# EAGLE design relay AZ850P2 THT (EAGLE 6.2)
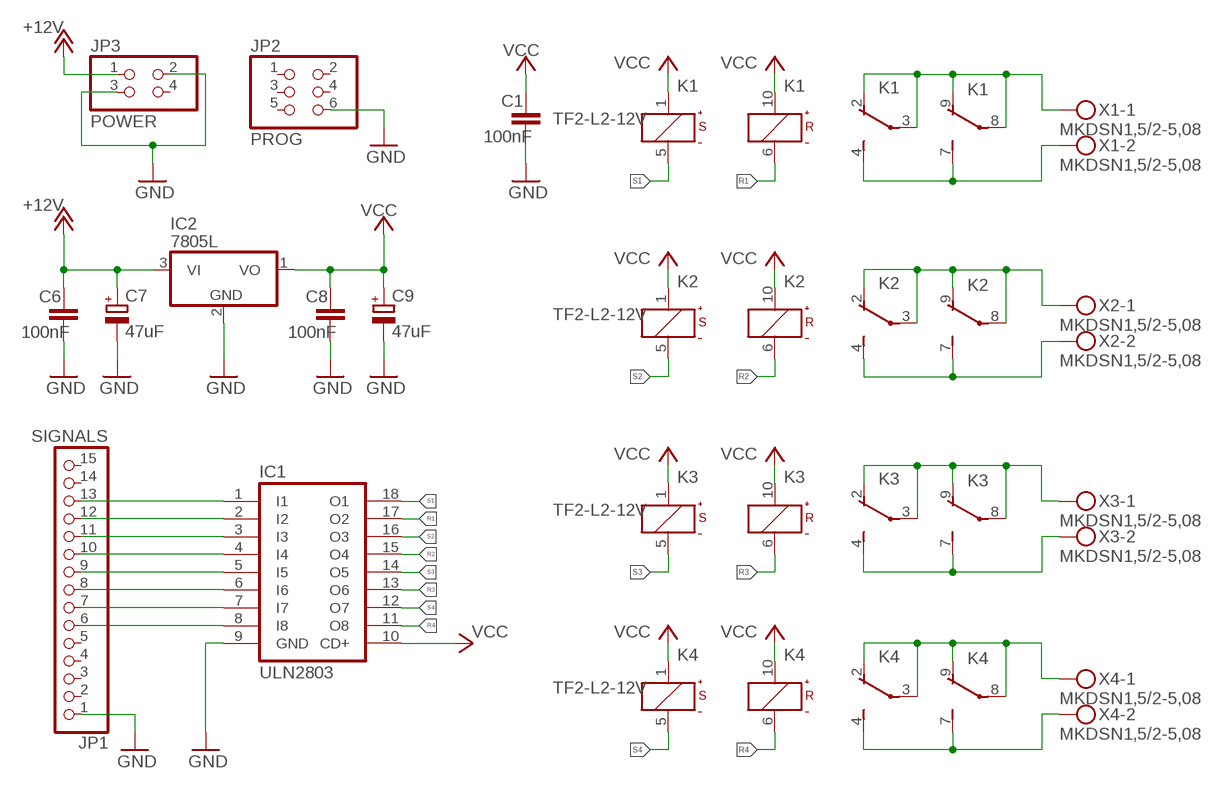
[diagram p0: schematic, sheet 1]

## Parts
C1  100nF  C-EU025-025X050  [C025-025X050]
C6  100nF  C-EU025-025X050  [C025-025X050]
C7  47uF  CPOL-EUE2.5-6  [E2,5-6]
C8  100nF  C-EU025-025X050  [C025-025X050]
C9  47uF  CPOL-EUE2.5-6  [E2,5-6]
IC1  ULN2803  ULN2803A  [DIL18]
IC2  7805L  [TO92]
JP1  SIGNALS  PINHD-1X15  [1X15]
JP2  PROG  PINHD-2X3  [2X03]
JP3  POWER  PINHD-2X2  [2X02]
K1  TF2-L2-12V  [TF2]
K2  TF2-L2-12V  [TF2]
K3  TF2-L2-12V  [TF2]
K4  TF2-L2-12V  [TF2]
X1  MKDSN1,5/2-5,08  [MKDSN1,5/2-5,08]
X2  MKDSN1,5/2-5,08  [MKDSN1,5/2-5,08]
X3  MKDSN1,5/2-5,08  [MKDSN1,5/2-5,08]
X4  MKDSN1,5/2-5,08  [MKDSN1,5/2-5,08]

## Nets
+12V: C6.1 C7.+ IC2.3(VI) JP3.1
GND: C1.2 C6.2 C7.- C8.2 C9.- IC1.9(GND) IC2.2(GND) JP1.1 JP2.6 JP3.2 JP3.3
N$1: IC1.1(I1) JP1.13
N$2: IC1.2(I2) JP1.12
N$3: IC1.3(I3) JP1.11
N$4: IC1.4(I4) JP1.10
N$5: IC1.5(I5) JP1.9
N$6: IC1.6(I6) JP1.8
N$7: IC1.7(I7) JP1.7
N$8: IC1.8(I8) JP1.6
N$9: K1.2(1:O) K1.3(1:P) K1.8(2:P) K1.9(2:O) X1.1
N$10: K1.4(1:S) K1.7(2:S) X1.2
N$11: K2.2(1:O) K2.3(1:P) K2.8(2:P) K2.9(2:O) X2.1
N$12: K2.4(1:S) K2.7(2:S) X2.2
N$13: K3.2(1:O) K3.3(1:P) K3.8(2:P) K3.9(2:O) X3.1
N$14: K3.4(1:S) K3.7(2:S) X3.2
N$15: K4.4(1:S) K4.7(2:S) X4.2
N$16: K4.2(1:O) K4.3(1:P) K4.8(2:P) K4.9(2:O) X4.1
R1: IC1.17(O2) K1.6(R:-)
R2: IC1.15(O4) K2.6(R:-)
R3: IC1.13(O6) K3.6(R:-)
R4: IC1.11(O8) K4.6(R:-)
S1: IC1.18(O1) K1.5(S:-)
S2: IC1.16(O3) K2.5(S:-)
S3: IC1.14(O5) K3.5(S:-)
S4: IC1.12(O7) K4.5(S:-)
VCC: C1.1 C8.1 C9.+ IC1.10(CD+) IC2.1(VO) K1.1(S:+) K1.10(R:+) K2.1(S:+) K2.10(R:+) K3.1(S:+) K3.10(R:+) K4.1(S:+) K4.10(R:+)
Unconnected: JP1.2 JP1.3 JP1.4 JP1.5 JP1.14 JP1.15 JP2.1 JP2.2 JP2.3 JP2.4 JP2.5 JP3.4

## Library data of the parts
C1 C6 C8 = rcl:C-EU: CAPACITOR, European symbol
C7 C9 = rcl:CPOL-EU: POLARIZED CAPACITOR, European symbol
IC1 = uln-udn:ULN2803A: DRIVER ARRAY
IC2 = linear:78*: Positive VOLTAGE REGULATOR Source: http://cache.national.com/ds/LM/LM78L05.pdf http://www.fairchildsemi.com/ds/LM/LM7805.pdf
JP1 = pinhead:PINHD-1X15: PIN HEADER
JP2 = pinhead:PINHD-2X3: PIN HEADER
JP3 = pinhead:PINHD-2X2: PIN HEADER
K1-K4 = relay:TF2-L2*: SMALL POLARIZED RELAY WITH HIGH SENSITIVITY NAiS 2 coil latching Source: http://www.mew-europe.com/.. en_ds_61017_0000.pdf; OC_FARNELL: unknown; OC_NEWARK: unknown
X1-X4 = con-phoenix-508:MKDSN1,5/2-5,08: MKDSN 1,5/ 2-5,08 Printklemme Nennstrom: 13,5 A Nennspannung: 250 V Rastermaß: 5,08 mm Polzahl: 2 Anschlussart: Schraubanschluss Montage: Löten Anschlussrichtung Leiter/Platine: 0 ° Artikelnummer: 1729128 Source: http://eshop.phoenixcontact.com .. 1729128.pdf; MPN: MKDSN 1,5/2-5.08; OC_FARNELL: 1792903; OC_NEWARK: 30M2397

## Board
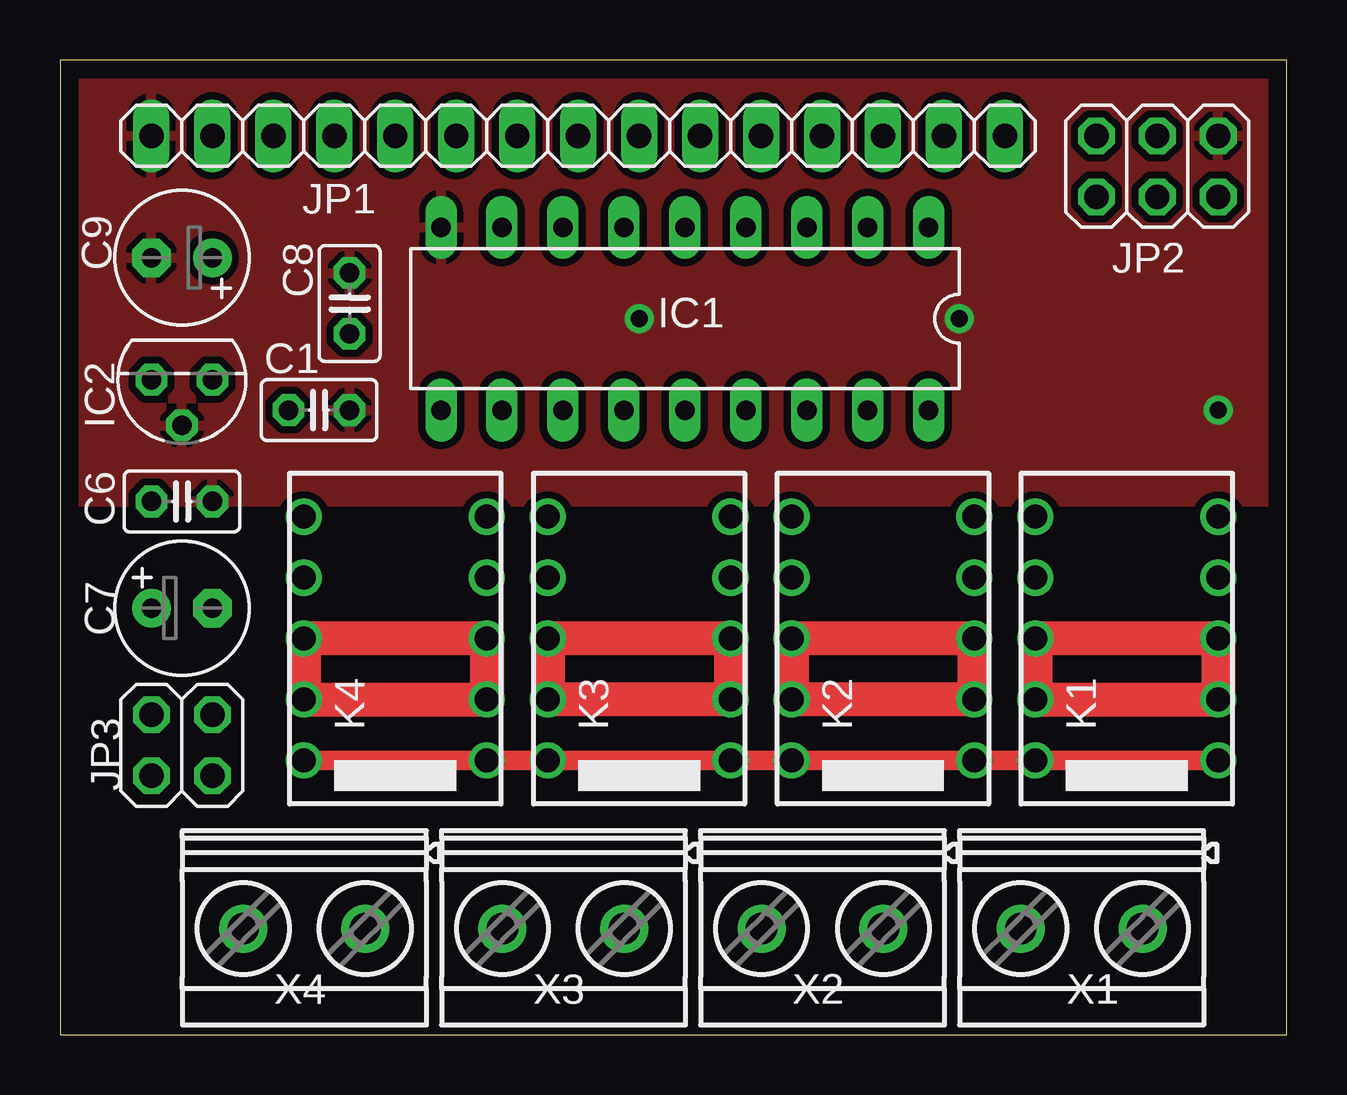
[diagram p1: board, top side]
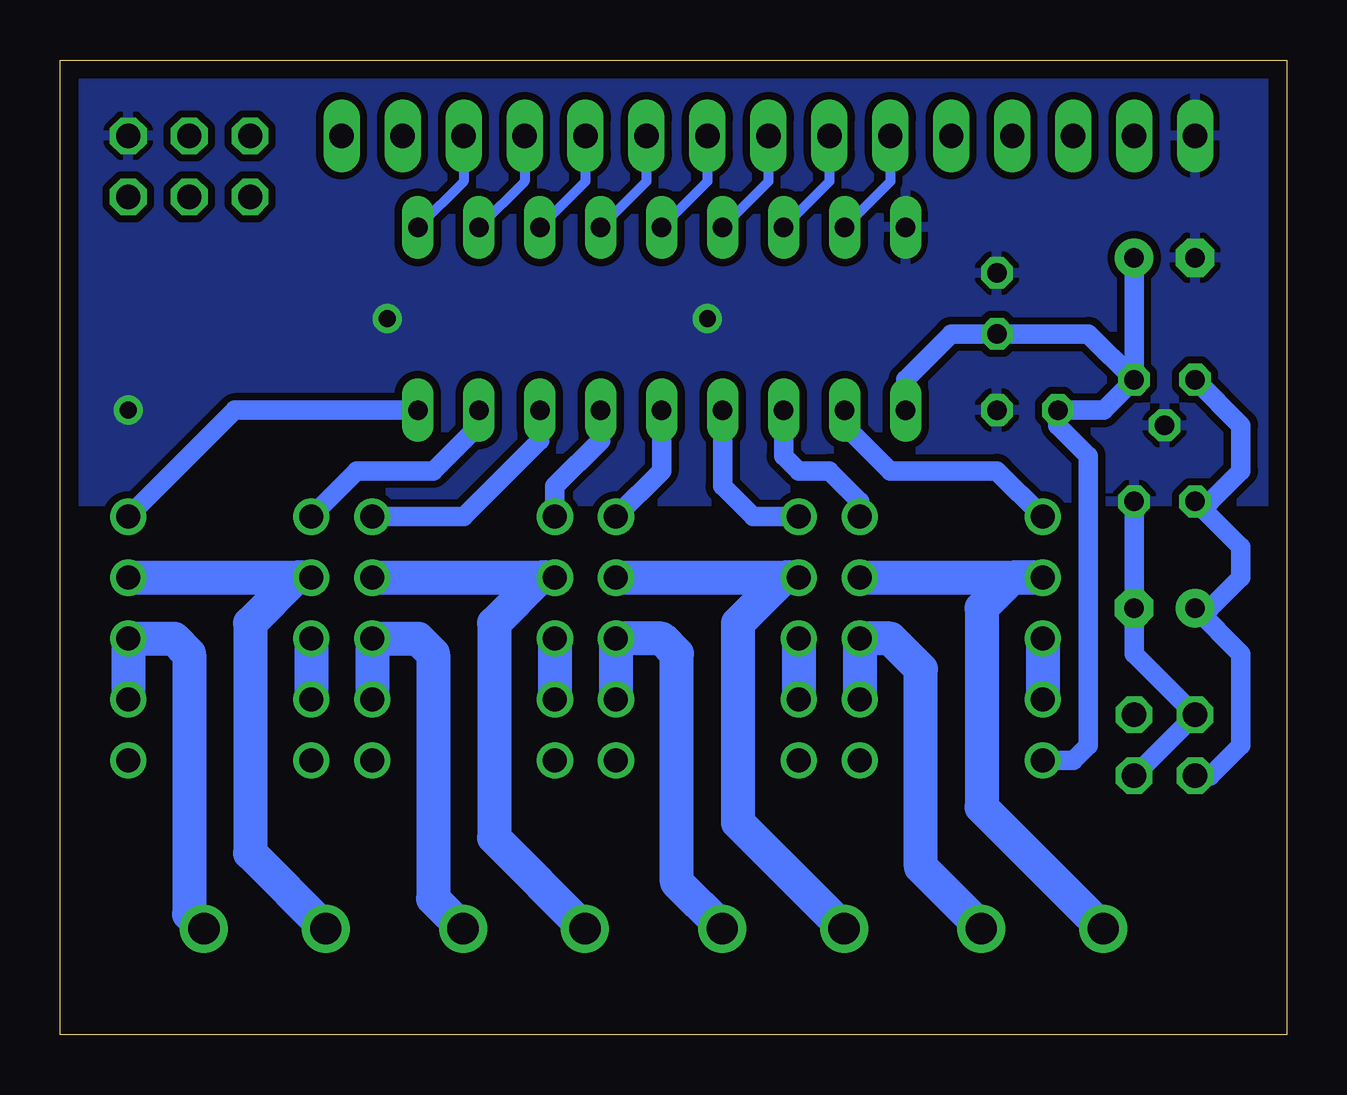
[diagram p2: board, bottom side, seen from below]

Size 51.1 x 40.63 mm. Coordinates in mm from the lower left corner, seen from the top.
Outline: 0,0 51.1,0 51.1,40.63 0,40.63 0,0
Copper layers (1*16): Top 0.035mm / dielectric 1.5mm / Bottom 0.035mm
Design rules: minimum track width 12mil, minimum drill 24mil, track to track 12mil, track to pad 12mil, pad to pad 12mil, via to via 12mil, smd to smd 8mil, copper to edge 30mil, drill to drill 12mil, minimum pad ring 10mil, minimum via ring 10mil, stop-mask expansion 4mil, vias tented up to drill 0mil, thermal gap 10mil

### Footprints (pad centres in the part's own frame; a part is rotated, then mirrored left to right if it is on the bottom)
C025-025X050 = drill 0.813 octagon: 1 -1.27,0; 2 1.27,0
E2,5-6 = drill 0.813 pad 1.6: + -1.27,0 | drill 0.813 pad 1.6 octagon: - 1.27,0
DIL18 = drill 0.813 long: 1 -10.16,-3.81; 2 -7.62,-3.81; 3 -5.08,-3.81; 4 -2.54,-3.81; 5 0,-3.81; 6 2.54,-3.81; 7 5.08,-3.81; 8 7.62,-3.81; 9 10.16,-3.81; 10 10.16,3.81; 11 7.62,3.81; 12 5.08,3.81; 13 2.54,3.81; 14 0,3.81; 15 -2.54,3.81; 16 -5.08,3.81; 17 -7.62,3.81; 18 -10.16,3.81
TO92 = drill 0.813 octagon: 1 -1.27,0; 2 0,1.905; 3 1.27,0
1X15 = drill 1.016 long: 1 -17.78,0; 2 -15.24,0; 3 -12.7,0; 4 -10.16,0; 5 -7.62,0; 6 -5.08,0; 7 -2.54,0; 8 0,0; 9 2.54,0; 10 5.08,0; 11 7.62,0; 12 10.16,0; 13 12.7,0; 14 15.24,0; 15 17.78,0
2X03 = drill 1.016 octagon: 1 -2.54,-1.27; 2 -2.54,1.27; 3 0,-1.27; 4 0,1.27; 5 2.54,-1.27; 6 2.54,1.27
2X02 = drill 1.016 octagon: 1 -1.27,-1.27; 2 -1.27,1.27; 3 1.27,-1.27; 4 1.27,1.27
TF2 = drill 1: 1 -5.08,-3.81; 2 -2.54,-3.81; 3 0,-3.81; 4 2.54,-3.81; 5 5.08,-3.81; 6 5.08,3.81; 7 2.54,3.81; 8 0,3.81; 9 -2.54,3.81; 10 -5.08,3.81
MKDSN1,5/2-5,08 = drill 1.3 pad 2: 1 -2.561,0.025; 2 2.519,0.025

### Placement (x,y rotation side)
C1  10.79,26.04 0 top
C6  5.08,22.23 0 top
C7  5.08,17.78 0 top
C8  12.06,30.48 90 top
C9  5.08,32.38 180 top
IC1  26.04,29.84 180 top
IC2  5.08,27.3 180 top
JP1  21.59,37.47 0 top
JP2  45.72,36.2 0 top
JP3  5.08,12.06 0 top
K1  44.45,16.51 90 top
K2  34.29,16.51 90 top
K3  24.13,16.51 90 top
K4  13.97,16.51 90 top
X1  42.55,4.45 180 top
X2  31.75,4.45 180 top
X3  20.95,4.45 180 top
X4  10.16,4.45 180 top

### Tracks (layer width: path | path; a pad name or v marks a point on that pad's centre or on a via)
+12V
  Bottom 0.813: JP3.1 3.17,10.79 1.91,12.06 1.91,15.88 C7.+ 3.17,17.78 1.91,19.05 1.91,20.32 C6.1 3.17,22.23 1.91,23.5 1.91,25.4 IC2.3
GND  (via drill 0.7)
  Bottom 0.813: C6.2 C7.- 6.35,15.88 JP3.2 JP3.3
  other vias: 24.13,29.84 37.47,29.84 48.26,26.04
  pour Bottom (isolate 0.305): -0.64,22.23 52.07,22.23 52.07,41.27 -0.64,41.27
  pour Top (isolate 0.305): -0.64,22.23 52.07,22.23 52.07,41.27 -0.64,41.27
N$1
  Bottom 0.406: JP1.13 34.29,35.56 IC1.1
N$2
  Bottom 0.406: JP1.12 31.75,35.56 IC1.2
N$3
  Bottom 0.406: JP1.11 29.21,35.56 IC1.3
N$4
  Bottom 0.406: JP1.10 26.67,35.56 IC1.4
N$5
  Bottom 0.406: JP1.9 24.13,35.56 IC1.5
N$6
  Bottom 0.406: JP1.8 21.59,35.56 IC1.6
N$7
  Bottom 0.406: JP1.7 19.05,35.56 IC1.7
N$8
  Bottom 0.406: JP1.6 16.51,35.56 IC1.8
N$9
  Top 1.422: K1.3 K1.8 K1.9 K1.2 K1.3
  Bottom 1.422: X1.1 45.72,5.03 45.72,15.88 46.35,16.51 K1.3 K1.2 | K1.8 K1.9
N$10
  Bottom 1.422: K1.4 K1.7 41.27,19.05 43.18,17.14 43.18,7.57 X1.2
N$11
  Top 1.422: K2.3 K2.8 K2.9 K2.2 K2.3
  Bottom 1.422: X2.1 35.56,5.67 35.56,15.88 36.2,16.51 K2.3 K2.2 | K2.8 K2.9
N$12
  Bottom 1.422: K2.4 K2.7 31.11,19.05 33.02,17.14 33.02,8.21 X2.2
N$13
  Top 1.422: K3.3 K3.8 K3.9 K3.2 K3.3
  Bottom 1.422: X3.1 23.52,4.47 25.4,6.35 25.4,15.88 26.04,16.51 K3.3 K3.2 | K3.8 K3.9
N$14
  Bottom 1.422: K3.4 K3.7 20.95,19.05 22.86,17.14 22.86,8.84 X3.2
N$15
  Bottom 1.422: K4.4 K4.7 11.43,19.05 12.7,17.78 12.7,9.48 X4.2
N$16
  Top 1.422: K4.3 K4.8 K4.9 K4.2 K4.3
  Bottom 1.422: X4.1 12.72,4.47 15.24,6.99 15.24,15.24 16.51,16.51 K4.3 K4.2 | K4.8 K4.9
R1
  Bottom 0.813: IC1.17 33.66,25.4 35.56,23.5 38.73,23.5 K1.6
R2
  Bottom 0.813: IC1.15 28.57,24.77 30.48,22.86 K2.6
R3
  Bottom 0.813: IC1.13 23.5,22.86 22.23,21.59 K3.6
R4
  Bottom 0.813: IC1.11 18.41,25.4 16.51,23.5 12.06,23.5 K4.6
S1
  Bottom 0.813: IC1.18 43.81,26.04 K1.5
S2
  Bottom 0.813: IC1.16 31.11,24.77 34.29,21.59 K2.5
S3
  Bottom 0.813: IC1.14 26.04,23.5 K3.5
S4
  Bottom 0.813: IC1.12 20.95,24.13 20.32,23.5 19.05,23.5 17.78,22.23 K4.5
VCC
  Top 0.813: K4.10 K4.1 K3.10 K3.1 K2.10 K2.1 K1.10 K1.1
  Bottom 0.813: IC2.1 7.62,26.04 C1.1 9.53,25.4 8.26,24.13 8.26,12.06 8.89,11.43 K4.10 | IC2.1 C9.+ | IC2.1 8.26,29.21 C8.1 13.97,29.21 15.88,27.3 IC1.10